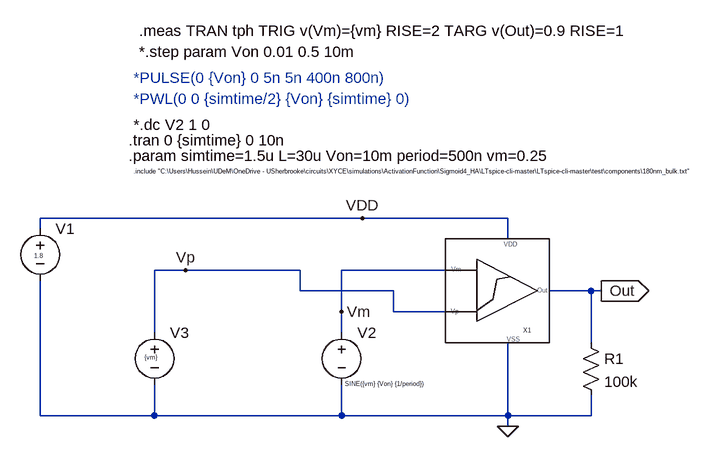
[diagram p0: schematic Test_comparator_HA.asc]
Test_comparator_HA.asc, the LTspice schematic file:
Version 4
SHEET 1 892 680
WIRE 256 64 -240 64
WIRE 480 64 256 64
WIRE -240 80 -240 64
WIRE 480 96 480 64
WIRE -16 144 -64 144
WIRE 160 144 -16 144
WIRE 384 144 224 144
WIRE 160 176 160 144
WIRE 304 176 160 176
WIRE 608 176 544 176
WIRE 624 176 608 176
WIRE 224 208 224 144
WIRE 304 208 304 176
WIRE 384 208 304 208
WIRE -64 240 -64 144
WIRE 224 240 224 208
WIRE 608 256 608 176
WIRE -240 368 -240 160
WIRE -64 368 -64 320
WIRE -64 368 -240 368
WIRE 224 368 224 320
WIRE 224 368 -64 368
WIRE 480 368 480 256
WIRE 480 368 224 368
WIRE 608 368 608 336
WIRE 608 368 480 368
WIRE 480 384 480 368
FLAG 480 384 0
FLAG 224 208 Vm
FLAG -16 144 Vp
FLAG 256 64 VDD
FLAG 624 176 Out
IOPIN 624 176 Out
SYMBOL comparator 464 176 R0
SYMATTR InstName X1
SYMBOL voltage -240 64 R0
WINDOW 3 -9 58 Left 0
WINDOW 123 0 0 Left 0
WINDOW 39 0 0 Left 0
SYMATTR Value 1.8
SYMATTR InstName V1
SYMBOL voltage 224 224 R0
WINDOW 3 5 95 Left 0
WINDOW 123 0 0 Left 0
WINDOW 39 0 0 Left 0
SYMATTR Value SINE({vm} {Von} {1/period})
SYMATTR InstName V2
SYMBOL voltage -64 224 R0
WINDOW 123 0 0 Left 0
WINDOW 39 0 0 Left 0
WINDOW 3 -15 54 Left 0
SYMATTR Value {vm}
SYMATTR InstName V3
SYMBOL res 592 240 R0
SYMATTR InstName R1
SYMATTR Value 100k
TEXT -96 -80 Left 2 !*.dc V2 1 0
TEXT -104 -56 Left 2 !.tran 0 {simtime} 0 10n
TEXT -104 -32 Left 2 !.param simtime=1.5u L=30u Von=10m period=500n vm=0.25
TEXT -96 -8 Left 0 !.include "C:\\Users\\Hussein\\UDeM\\OneDrive - USherbrooke\\circuits\\XYCE\\simulations\\ActivationFunction\\Sigmoid4_HA\\LTspice-cli-master\\LTspice-cli-master\\test\\components\\180nm_bulk.txt"
TEXT -96 -120 Left 2 ;*PWL(0 0 {simtime/2} {Von} {simtime} 0)
TEXT -96 -152 Left 2 ;*PULSE(0 {Von} 0 5n 5n 400n 800n)
TEXT -88 -192 Left 2 !*.step param Von 0.01 0.5 10m
TEXT -88 -224 Left 2 !.meas TRAN tph TRIG v(Vm)={vm} RISE=2 TARG v(Out)=0.9 RISE=1

The netlist it stands for:
* Test_comparator_HA.asc
XX1 Vm Vp VDD 0 Out comparator  ; pins Vm Vp VDD VSS Out
V1 VDD 0 1.8
V2 Vm 0 SINE({vm} {Von} {1/period})
V3 Vp 0 {vm}
R1 Out 0 100k
*.dc V2 1 0
.tran 0 {simtime} 0 10n
.param simtime=1.5u L=30u Von=10m period=500n vm=0.25
.include "C:\Users\Hussein\UDeM\OneDrive - USherbrooke\circuits\XYCE\simulations\ActivationFunction\Sigmoid4_HA\LTspice-cli-master\LTspice-cli-master\test\components\180nm_bulk.txt"
* *PWL(0 0 {simtime/2} {Von} {simtime} 0)
* *PULSE(0 {Von} 0 5n 5n 400n 800n)
*.step param Von 0.01 0.5 10m
.meas TRAN tph TRIG v(Vm)={vm} RISE=2 TARG v(Out)=0.9 RISE=1
.backanno
.end

* Results of the author's LTspice run, read from the files saved beside the schematic
* Operating Point, zero values left out:
*   V(vp) = 250 mV
*   V(vdd) = 1.8 V
*   V(vm) = 250 mV
*   V(out) = 1.776 V
*   I(R1) = 17.76 µA
*   I(V1) = -265.2 µA
*   Ix(x1:VDD) = 265.2 µA
*   Ix(x1:VSS) = -247.4 µA
*   Ix(x1:OUT) = -17.76 µA
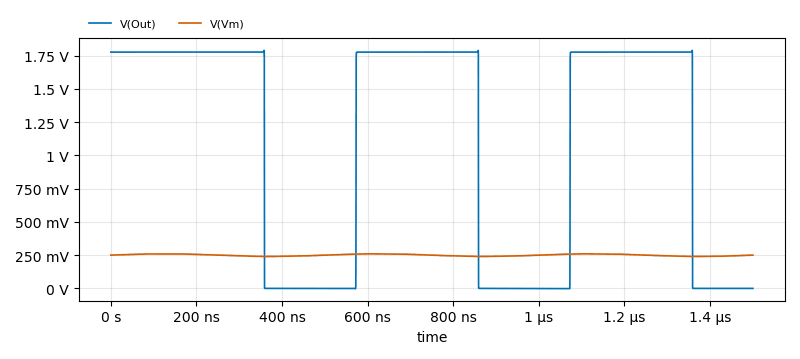
[diagram p1: Transient Analysis of Test_comparator_HA.asc, plotted from the saved traces]
* Transient Analysis, 1 run:
*   V(Out): min -3.005 mV, max 1.789 V, average 1.102 V, rms 1.398 V, last 0 V
*   V(Vm): min 240 mV, max 259.7 mV, average 249.9 mV, rms 250 mV, last 250 mV